# Altium schematic sheet DDR3L_16bits.SchDoc: DDR3L 16bits
size A3; Date: Not used; ApprovedBy: Not used; CheckedBy: Not used; Author: Not used; CompanyName: STMicroelectronics; DrawnBy: Not used; Engineer: Not used; Organization: Not used; Address1: Not used; Address2: Not used; Address3: Not used; Address4: Not used; DocumentNumber: 6; Revision: Not used; SheetNumber: 6; SheetTotal: 17; CurrentTime: Not used; CurrentDate: Not used; Time: Not used; DocumentFullPathAndName: Not used; DocumentName: Not used; ModifiedDate: Not used; ImagePath: Not used; ProjectName: Not used; Application_BuildNumber: Not used
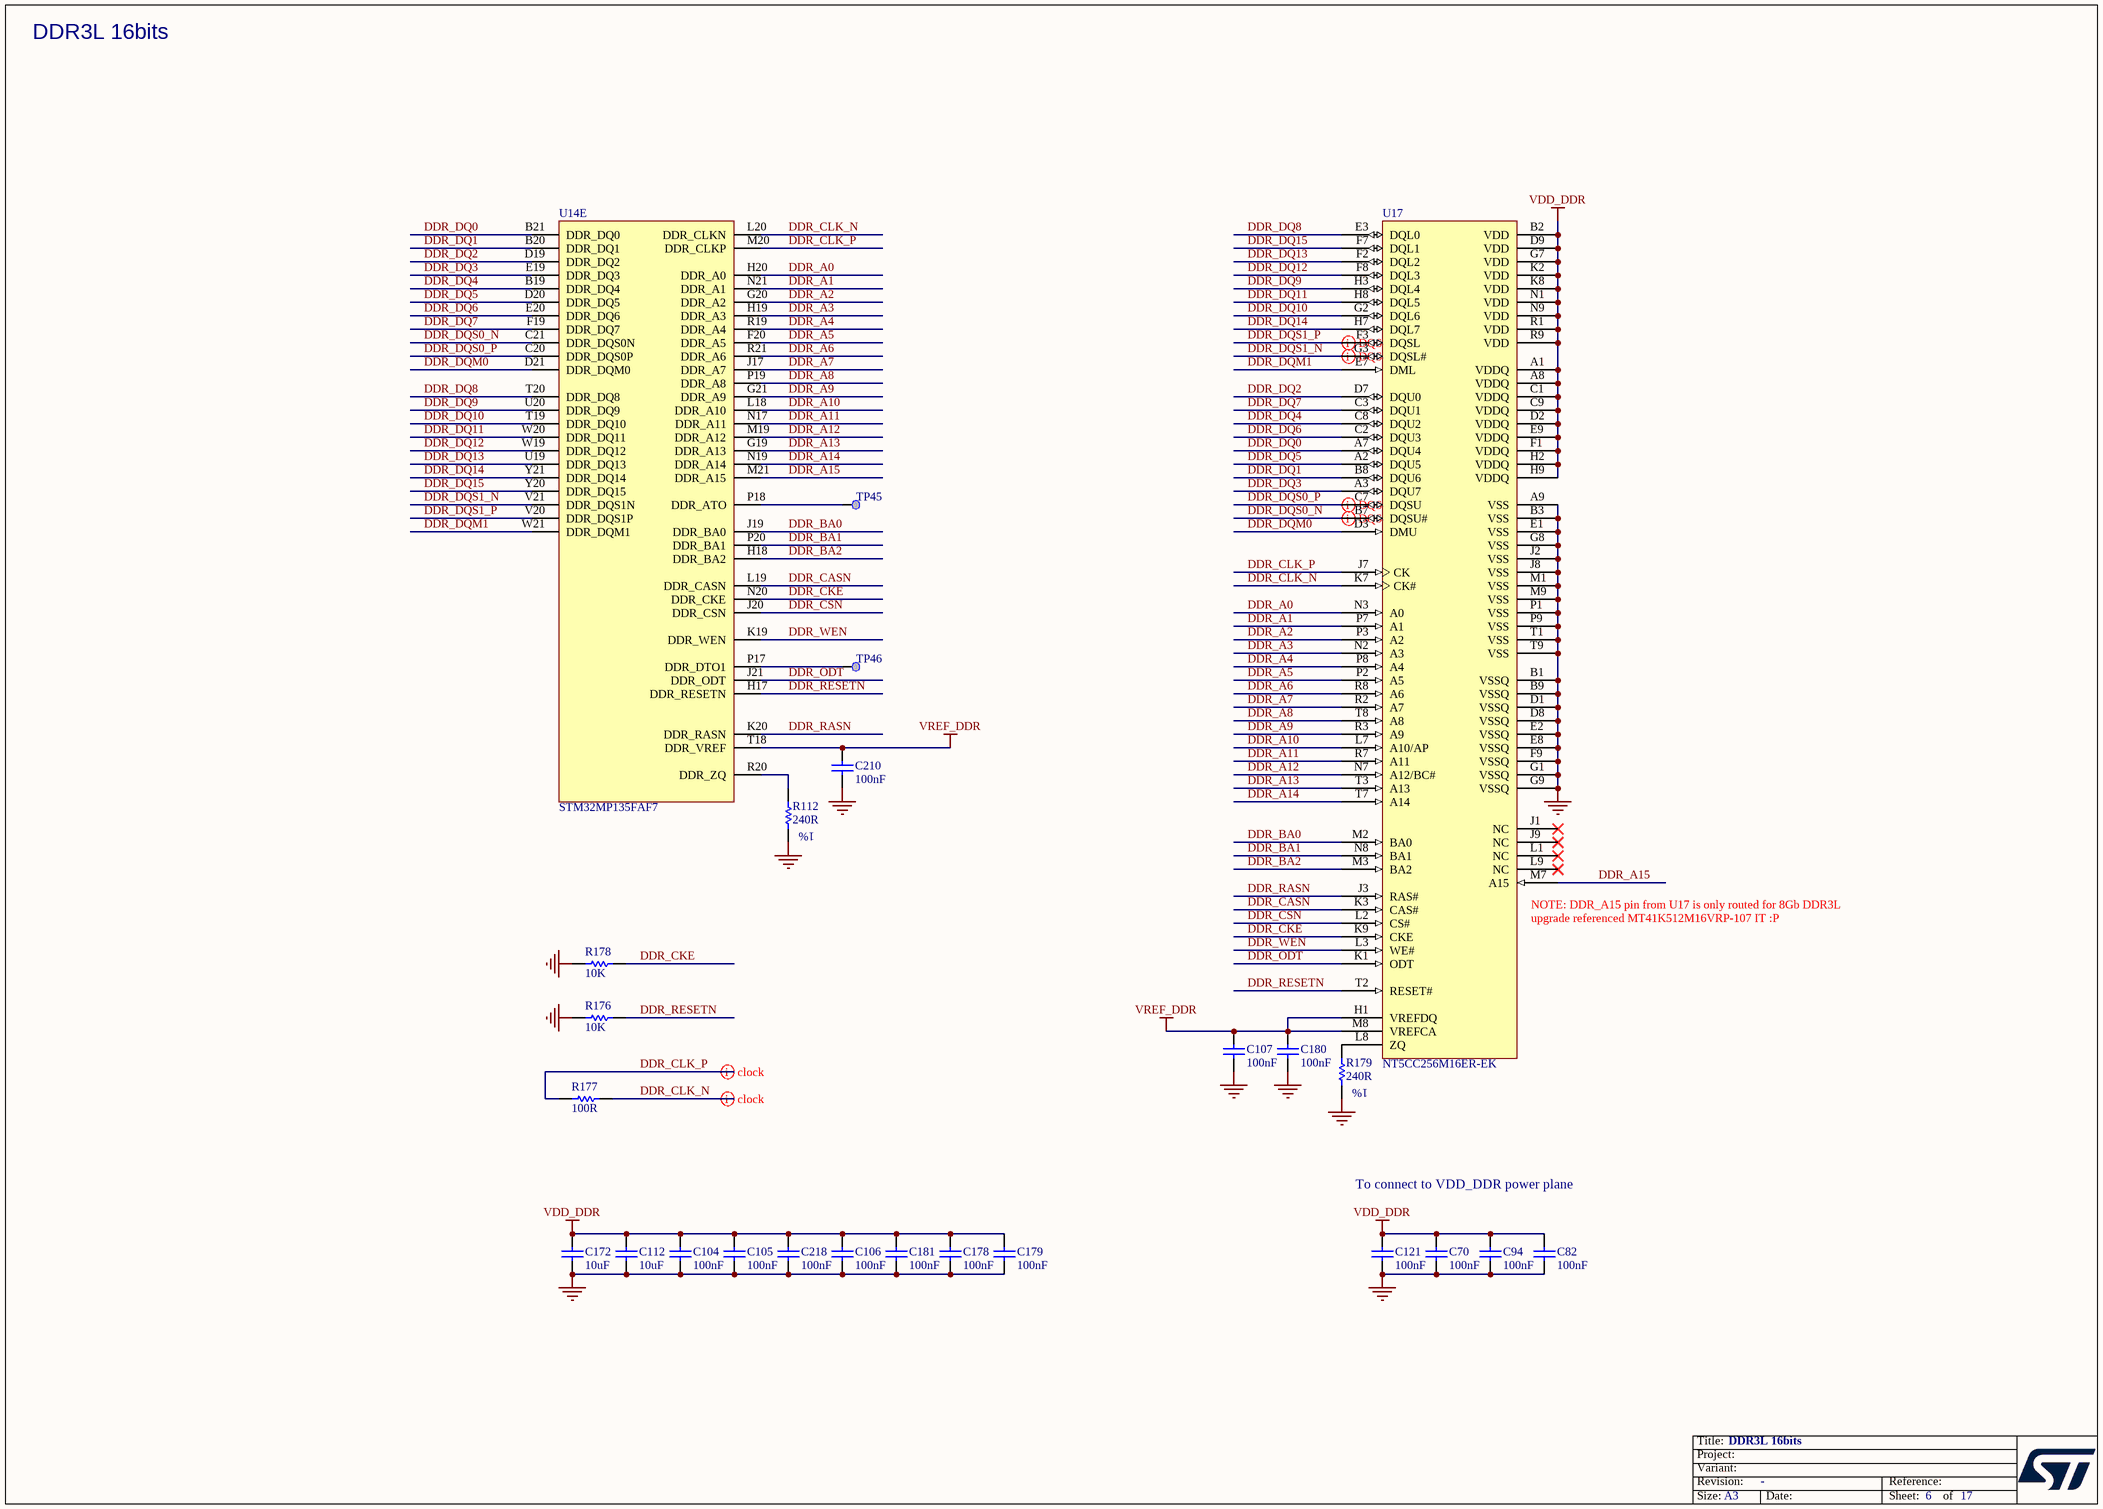
[diagram p0: DDR3L_16bits.SchDoc]

## Parts
C70  value 100nF  [C0402]  (hidden comment: Capacitor)
C82  value 100nF  [C0402]  (hidden comment: Capacitor)
C94  value 100nF  [C0402]  (hidden comment: Capacitor)
C104  value 100nF  [C0402]  (hidden comment: Capacitor)
C105  value 100nF  [C0402]  (hidden comment: Capacitor)
C106  value 100nF  [C0402]  (hidden comment: Capacitor)
C107  value 100nF  [C0402]  (hidden comment: Capacitor)
C112  value 10uF  [C0603]  (hidden comment: Capacitor)
C121  value 100nF  [C0402]  (hidden comment: Capacitor)
C172  value 10uF  [C0603]  (hidden comment: Capacitor)
C178  value 100nF  [C0402]  (hidden comment: Capacitor)
C179  value 100nF  [C0402]  (hidden comment: Capacitor)
C180  value 100nF  [C0402]  (hidden comment: Capacitor)
C181  value 100nF  [C0402]  (hidden comment: Capacitor)
C210  value 100nF  [C0402]  (hidden comment: Capacitor)
C218  value 100nF  [C0402]  (hidden comment: Capacitor)
R112  value 240R  [R0402]  (hidden comment: Resistor)
R176  value 10K  [R0402]  (hidden comment: Resistor)
R177  value 100R  [R0402]  (hidden comment: Resistor)
R178  value 10K  [R0402]  (hidden comment: Resistor)
R179  value 240R  [R0402]  (hidden comment: Resistor)
TP45  Test Point  [TP_SMD_1MM]  (value not drawn)  (no BOM)
TP46  Test Point  [TP_SMD_1MM]  (value not drawn)  (no BOM)
U14  STM32MP135FAF7  [ICC_TFBGA320_11X11_STM32MP135FA7_P050_H1P20]  (part E of 5)
U17  NT5CC256M16ER-EK  [ICC_VFBGA96_9x13_P080]

## Nets
GND: C70.1 C82.1 C94.1 C104.1 C105.1 C106.1 C107.2 C112.1 C121.1 C172.1 C178.1 C179.1 C180.2 C181.1 C210.2 C218.1 R112.1 R176.1 R178.1 R179.1 U17.A9(VSS) U17.B1(VSSQ) U17.B3(VSS) U17.B9(VSSQ) U17.D1(VSSQ) U17.D8(VSSQ) U17.E1(VSS) U17.E2(VSSQ) U17.E8(VSSQ) U17.F9(VSSQ) U17.G1(VSSQ) U17.G8(VSS) U17.G9(VSSQ) U17.J2(VSS) U17.J8(VSS) U17.M1(VSS) U17.M9(VSS) U17.P1(VSS) U17.P9(VSS) U17.T1(VSS) U17.T9(VSS)
VDD_DDR: C70.2 C82.2 C94.2 C104.2 C105.2 C106.2 C112.2 C121.2 C172.2 C178.2 C179.2 C181.2 C218.2 U17.A1(VDDQ) U17.A8(VDDQ) U17.B2(VDD) U17.C1(VDDQ) U17.C9(VDDQ) U17.D2(VDDQ) U17.D9(VDD) U17.E9(VDDQ) U17.F1(VDDQ) U17.G7(VDD) U17.H2(VDDQ) U17.H9(VDDQ) U17.K2(VDD) U17.K8(VDD) U17.N1(VDD) U17.N9(VDD) U17.R1(VDD) U17.R9(VDD)
VREF_DDR: C107.1 C180.1 C210.1 U14.T18(DDR_VREF) U17.H1(VREFDQ) U17.M8(VREFCA)
DDR_A0: U14.H20(DDR_A0) U17.N3(A0)
DDR_A1: U14.N21(DDR_A1) U17.P7(A1)
DDR_A2: U14.G20(DDR_A2) U17.P3(A2)
DDR_A3: U14.H19(DDR_A3) U17.N2(A3)
DDR_A4: U14.R19(DDR_A4) U17.P8(A4)
DDR_A5: U14.F20(DDR_A5) U17.P2(A5)
DDR_A6: U14.R21(DDR_A6) U17.R8(A6)
DDR_A7: U14.J17(DDR_A7) U17.R2(A7)
DDR_A8: U14.P19(DDR_A8) U17.T8(A8)
DDR_A9: U14.G21(DDR_A9) U17.R3(A9)
DDR_A10: U14.L18(DDR_A10) U17.L7(A10/AP)
DDR_A11: U14.N17(DDR_A11) U17.R7(A11)
DDR_A12: U14.M19(DDR_A12) U17.N7(A12/BC#)
DDR_A13: U14.G19(DDR_A13) U17.T3(A13)
DDR_A14: U14.N19(DDR_A14) U17.T7(A14)
DDR_A15: U14.M21(DDR_A15) U17.M7(A15)
DDR_BA0: U14.J19(DDR_BA0) U17.M2(BA0)
DDR_BA1: U14.P20(DDR_BA1) U17.N8(BA1)
DDR_BA2: U14.H18(DDR_BA2) U17.M3(BA2)
DDR_CASN: U14.L19(DDR_CASN) U17.K3(CAS#)
DDR_CKE: R178.2 U14.N20(DDR_CKE) U17.K9(CKE)
DDR_CLK_N: R177.2 U14.L20(DDR_CLKN) U17.K7(CK#)
DDR_CLK_P: R177.1 U14.M20(DDR_CLKP) U17.J7(CK)
DDR_CSN: U14.J20(DDR_CSN) U17.L2(CS#)
DDR_DQ0: U14.B21(DDR_DQ0) U17.A7(DQU4)
DDR_DQ1: U14.B20(DDR_DQ1) U17.B8(DQU6)
DDR_DQ2: U14.D19(DDR_DQ2) U17.D7(DQU0)
DDR_DQ3: U14.E19(DDR_DQ3) U17.A3(DQU7)
DDR_DQ4: U14.B19(DDR_DQ4) U17.C8(DQU2)
DDR_DQ5: U14.D20(DDR_DQ5) U17.A2(DQU5)
DDR_DQ6: U14.E20(DDR_DQ6) U17.C2(DQU3)
DDR_DQ7: U14.F19(DDR_DQ7) U17.C3(DQU1)
DDR_DQ8: U14.T20(DDR_DQ8) U17.E3(DQL0)
DDR_DQ9: U14.U20(DDR_DQ9) U17.H3(DQL4)
DDR_DQ10: U14.T19(DDR_DQ10) U17.G2(DQL6)
DDR_DQ11: U14.W20(DDR_DQ11) U17.H8(DQL5)
DDR_DQ12: U14.W19(DDR_DQ12) U17.F8(DQL3)
DDR_DQ13: U14.U19(DDR_DQ13) U17.F2(DQL2)
DDR_DQ14: U14.Y21(DDR_DQ14) U17.H7(DQL7)
DDR_DQ15: U14.Y20(DDR_DQ15) U17.F7(DQL1)
DDR_DQM0: U14.D21(DDR_DQM0) U17.D3(DMU)
DDR_DQM1: U14.W21(DDR_DQM1) U17.E7(DML)
DDR_DQS0_N: U14.C21(DDR_DQS0N) U17.B7(DQSU#)
DDR_DQS0_P: U14.C20(DDR_DQS0P) U17.C7(DQSU)
DDR_DQS1_N: U14.V21(DDR_DQS1N) U17.G3(DQSL#)
DDR_DQS1_P: U14.V20(DDR_DQS1P) U17.F3(DQSL)
DDR_ODT: U14.J21(DDR_ODT) U17.K1(ODT)
DDR_RASN: U14.K20(DDR_RASN) U17.J3(RAS#)
DDR_RESETN: R176.2 U14.H17(DDR_RESETN) U17.T2(RESET#)
DDR_WEN: U14.K19(DDR_WEN) U17.L3(WE#)
NetR112_2: R112.2 U14.R20(DDR_ZQ)
NetR179_2: R179.2 U17.L8(ZQ)
NetTP45_1: TP45.1 U14.P18(DDR_ATO)
NetTP46_1: TP46.1 U14.P17(DDR_DTO1)

Not connected (* = marked no-connect by the designer): U17 J1(NC)* J9(NC)* L1(NC)* L9(NC)*

## Layout directives
differential pair: DDR_CLK_N, DDR_CLK_P, DDR_DQS0_N, DDR_DQS0_P, DDR_DQS1_N, DDR_DQS1_P

## Notes on the sheet
- DDR3L 16bits
- (near R112) 1%
- (near U17) NOTE: DDR_A15 pin from U17 is only routed for 8Gb DDR3L upgrade referenced MT41K512M16VRP-107 IT :P
- (near R179) 1%
- To connect to VDD_DDR power plane
- Title:
- Project:
- Size:
- Revision:
- Variant:
- A3
- -
- Date:
- Reference:
- Sheet:
- of

## Library data of the parts
C70 C82 C94 C104-C106 C121 C178 C179 C181 C210 C218 = MCD-00006: Capacitor, MLCC, 100nF, 16V, X7R, +/-10%, 0402, T=0.5mm; Manufacturer: YAGEO; Manufacturer_Part_Number: CC0402KRX7R7BB104; Part_Preference: Recommended; Order_Code_RS: 616-9701; Component_Country_Of_Origin: China; ShowFields: YES; ID: 2474; Internal_Part_Number: MCD-00006; Status: Released; Part_Type: Capacitor; Package: 0402; ComponentLink1URL: http://tunmcdsvn.tun.st.com/Component_Documentation_Library/Trunk/Capacitor/YAGEO_X7R_Series; Order_Code_Digikey: 311-1338-1-ND; Order_Code_Farnell: 9402047
C107 C180 = MCD-00006: Capacitor, MLCC, 100nF, 16V, X7R, +/-10%, 0402, T=0.5mm; Manufacturer_Part_Number: CC0402KRX7R7BB104; Manufacturer: YAGEO; Part_Preference: Recommended; Order_Code_RS: 616-9701; Component_Country_Of_Origin: China; ShowFields: YES; ID: 2474; Internal_Part_Number: MCD-00006; Status: Released; Part_Type: Capacitor; Package: 0402; ComponentLink1URL: http://tunmcdsvn.tun.st.com/Component_Documentation_Library/Trunk/Capacitor/YAGEO_X7R_Series; Order_Code_Digikey: 311-1338-1-ND; Order_Code_Farnell: 9402047
C112 C172 = MCD-00099: Capacitor, MLCC, 10uF, 10V, X5R, +/-10%, 0603, T=0.8mm; Manufacturer_Part_Number: GRM188R61A106KE69D; Manufacturer: MURATA; Part_Preference: Recommended; Order_Code_RS: 170-6168; Component_Country_Of_Origin: Japan; ShowFields: YES; ID: 2770; Internal_Part_Number: MCD-00099; Status: Released; Part_Type: Capacitor; Package: 0603; ComponentLink1URL: http://tunmcdsvn.tun.st.com/Component_Documentation_Library/Trunk/Capacitor/MURATA_GRM_Series; Order_Code_Digikey: 490-10474-1-ND; Order_Code_Farnell: 2494233
R112 = MCD-00120: Resistor, 240R, 0402, +/-1%, 1/16W; Manufacturer: YAGEO; Manufacturer_Part_Number: RC0402FR-07240RL; Part_Preference: Recommended; Component_Country_Of_Origin: China; ShowFields: YES; ID: 2745; Internal_Part_Number: MCD-00120; Status: Released; Part_Type: Resistor; Package: 0402; ComponentLink1URL: http://tunmcdsvn.tun.st.com/Component_Documentation_Library/Trunk/Resistor/YAGEO_RC_L_Series; Order_Code_Digikey: 311-240LRCT-ND; Order_Code_Farnell: 1458766; Order_Code_RS: N/A
R176 R178 = MCD-00053: Resistor, 10K, 0402, +/-1%, 1/16W; Manufacturer_Part_Number: RC0402FR-0710KL; Manufacturer: YAGEO; BMS_Part_Number: 9131590; Part_Preference: Recommended; Component_Country_Of_Origin: China; ShowFields: YES; ID: 2539; Internal_Part_Number: MCD-00053; Status: Released; Part_Type: Resistor; Package: 0402; ComponentLink1URL: http://tunmcdsvn.tun.st.com/Component_Documentation_Library/Trunk/Resistor/YAGEO_RC_L_Series; Order_Code_Digikey: 311-10.0KLRCT-ND; Order_Code_Farnell: 9239359; Order_Code_RS: N/A
R177 = MCD-00067: Resistor, 100R, 0402, +/- 1%, 1/16W; Manufacturer_Part_Number: RC0402FR-07100RL; Manufacturer: YAGEO; Part_Preference: Recommended; Component_Country_Of_Origin: China; ShowFields: YES; ID: 2527; Internal_Part_Number: MCD-00067; Status: Released; Part_Type: Resistor; Package: 0402; ComponentLink1URL: http://tunmcdsvn.tun.st.com/Component_Documentation_Library/Trunk/Resistor/YAGEO_RC_L_Series; Order_Code_Digikey: 311-100LRCT-ND; Order_Code_Farnell: 9239111; Order_Code_RS: N/A
R179 = MCD-00120: Resistor, 240R, 0402, +/-1%, 1/16W; Manufacturer_Part_Number: RC0402FR-07240RL; Manufacturer: YAGEO; Part_Preference: Recommended; Component_Country_Of_Origin: China; ShowFields: YES; ID: 2745; Internal_Part_Number: MCD-00120; Status: Released; Part_Type: Resistor; ComponentLink1URL: http://tunmcdsvn.tun.st.com/Component_Documentation_Library/Trunk/Resistor/YAGEO_RC_L_Series; Package: 0402; Order_Code_Digikey: 311-240LRCT-ND; Order_Code_Farnell: 1458766; Order_Code_RS: N/A
TP45 TP46 = MCD-00074: Test Point 1mm; Part_Type: Misc; Part_Preference: Recommended; ShowFields: YES; ID: 2518; Internal_Part_Number: MCD-00074; Status: Released; ComponentLink1URL: http://na; Manufacturer: N/A; Manufacturer_Part_Number: N/A; Order_Code_Digikey: N/A; Order_Code_Farnell: N/A; Order_Code_RS: N/A
U14 = MCD-02251: Cortex-A7 @ 900MHz, 128KB-ROM, 128KB-SRAM, 2x Ethernet, 2x ADC, 2x CAN FD, TSC, Camera, Display, Secure Boot, Cryptography, DRAM enc/dec, PKA; Part_Preference: Recommended; Part_Type: IC; Manufacturer: STMICROELECTRONICS; Manufacturer_HQ_COO: EU; Component_Country_Of_Origin: Unknown; ShowFields: YES; ID: 4351; Internal_Part_Number: MCD-02251; Value: STM32MP135FAF7; Status: Checked; Manufacturer_Part_Number: STM32MP135FAF7; Package: TFBGA320; ComponentLink1URL: http://tunmcdsvn.tun.st.com/Component_Datasheet_Library/Trunk/Socket_IC/STM_MPU_STM32MP135FAF7_Socket; Order_Code_Digikey: N/A; Order_Code_Farnell: N/A; Order_Code_RS: N/A
U17 = MCD-01811: Memory,DDR3L,4Gb,256Mbx16,933Mhz,1V35,TFBGA; Part_Preference: Recommended; Part_Type: IC; Manufacturer: NANYA; BMS_Part_Number: 9171435; Component_Country_Of_Origin: Taiwan; ShowFields: YES; ID: 3911; Internal_Part_Number: MCD-01811; Value: NT5CC256M16ER-EK; Status: Released; Manufacturer_Part_Number: NT5CC256M16ER-EK; ComponentLink1URL: http://tunmcdsvn.tun.st.com/Component_Datasheet_Library/Trunk/IC/Nanya_DDR3_NT5CC256M16ER-EK